# Altium schematic sheet S7CAS-PLEIADES-CARTE-MERE_P06_USB_PROGRAMER.SCHDOC
size Tabloid; SheetNumber: 18; SheetTotal: 18; Sheet_Name: USB_PROGRAMMER; Size: 11x17
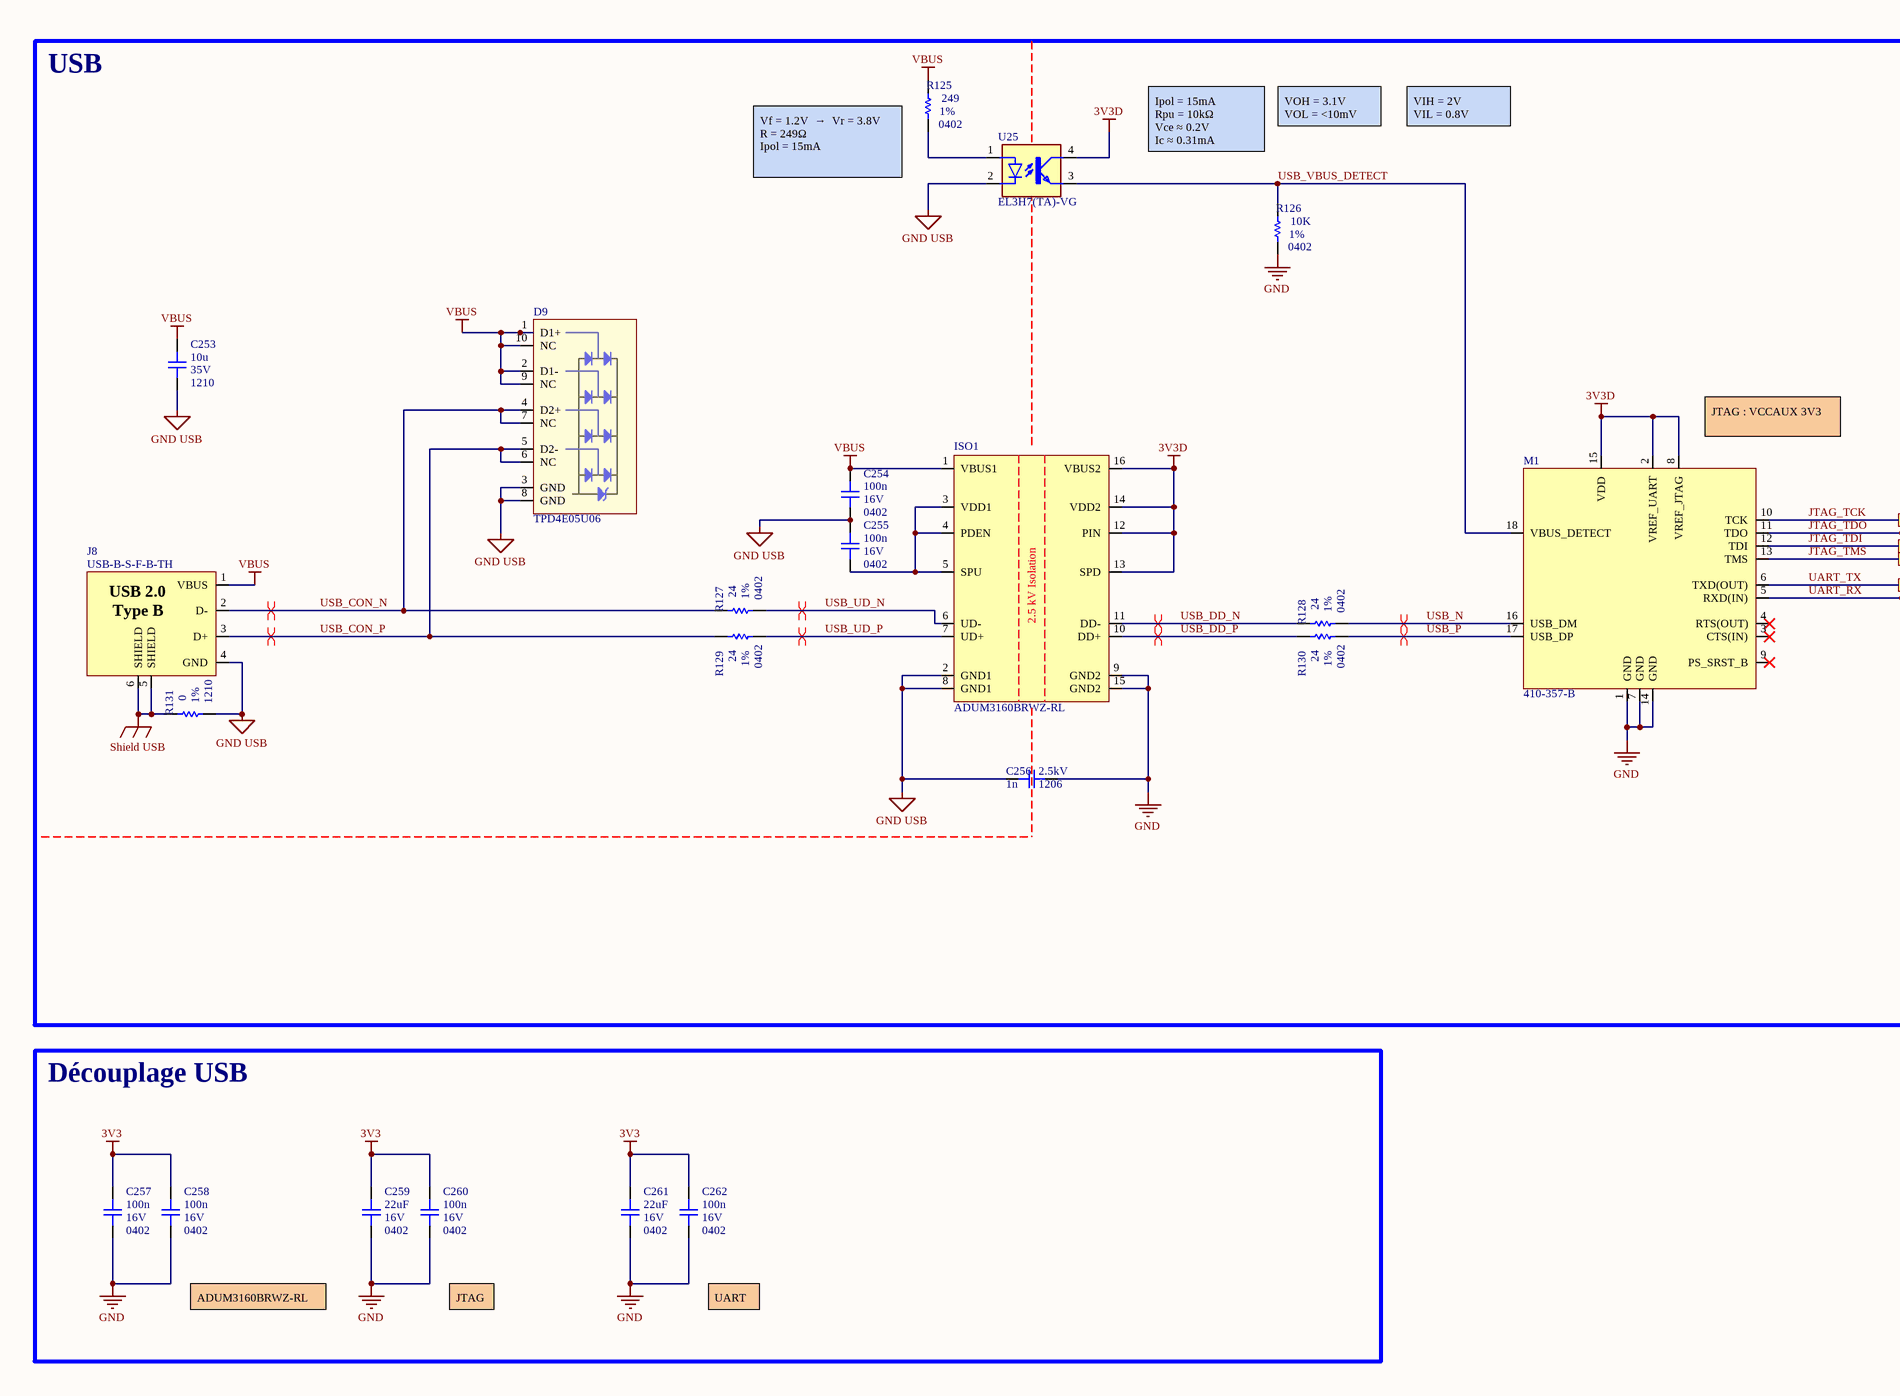
[diagram p0: S7CAS-PLEIADES-CARTE-MERE_P06_USB_PROGRAMER.SCHDOC, left]
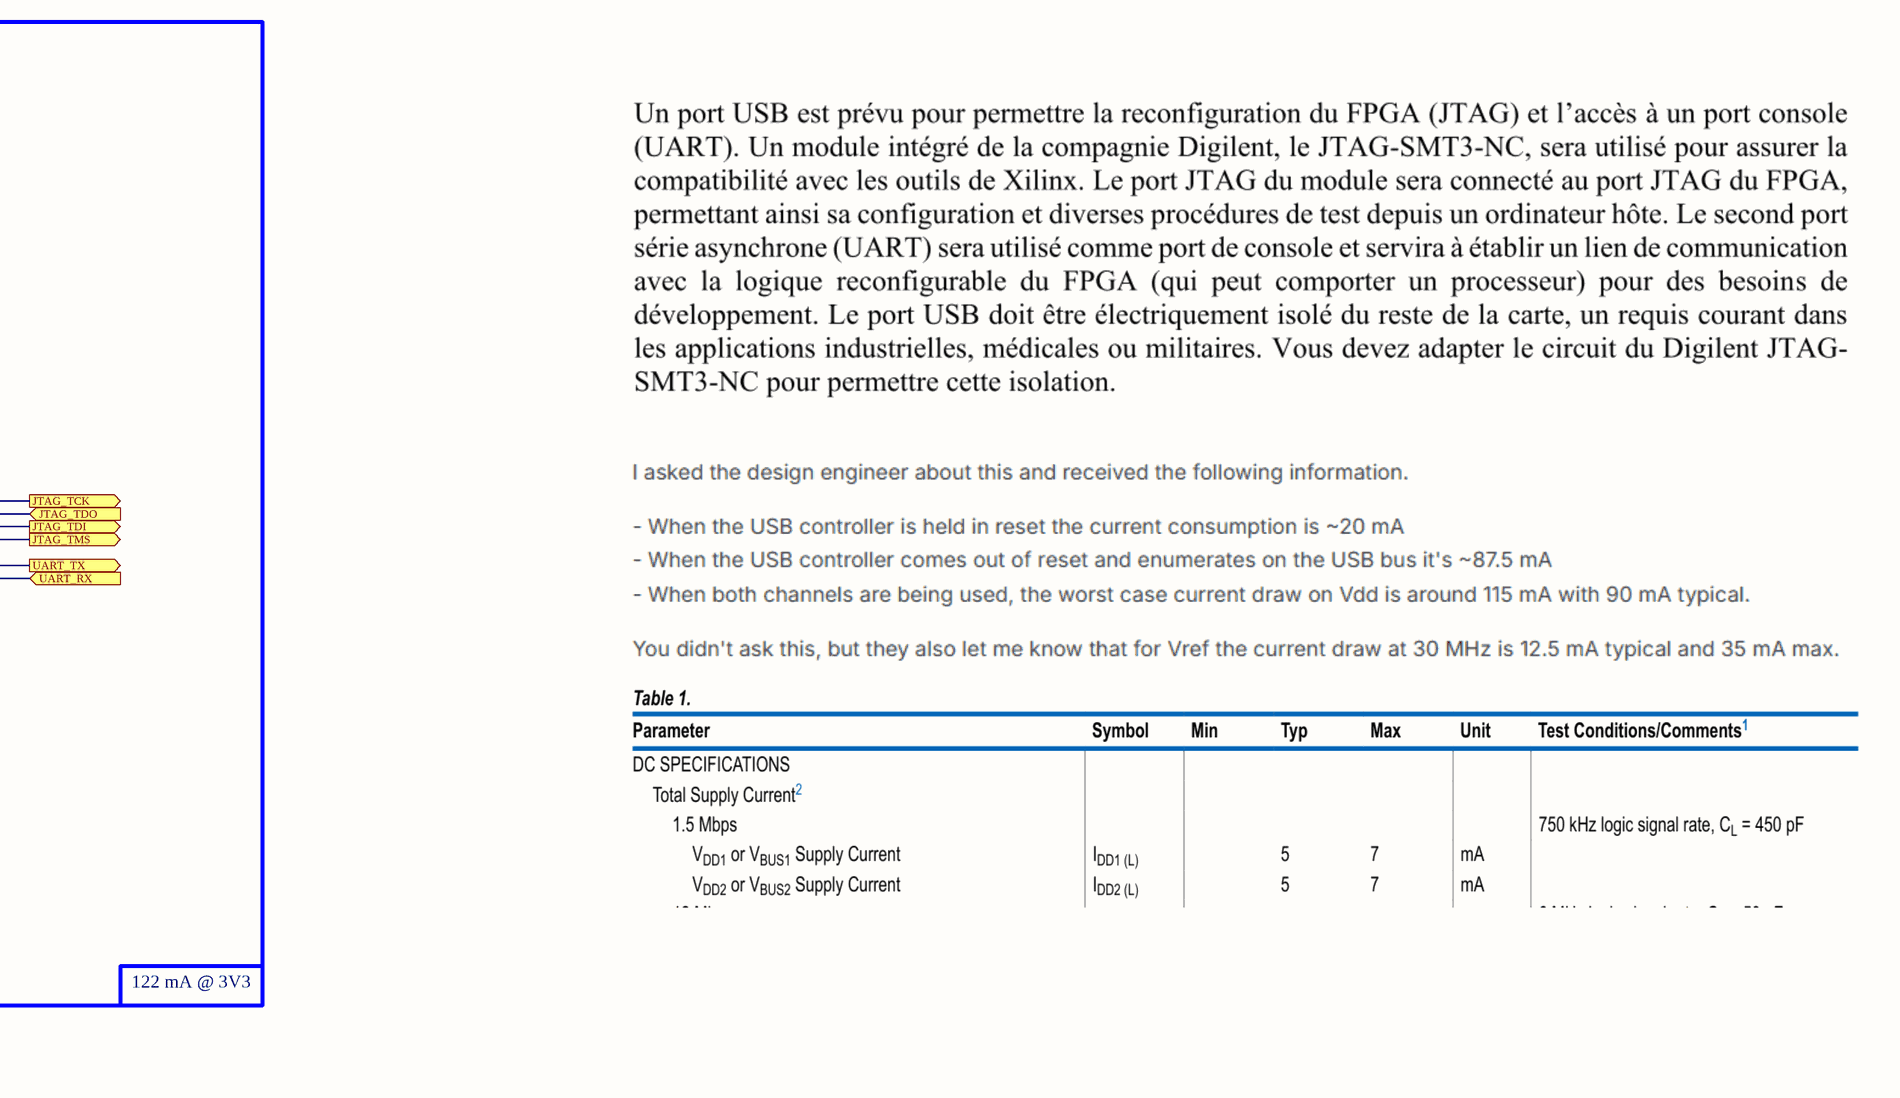
[diagram p1: S7CAS-PLEIADES-CARTE-MERE_P06_USB_PROGRAMER.SCHDOC, right]

## Parts
C253  value 10u  Voltage: 35V  Package: 1210  [CAP_1210]  (hidden comment: CAP - 1210)
C254  value 100n  Voltage: 16V  Package: 0402  [CAP_0402]  (hidden comment: CAP - 0402)
C255  value 100n  Voltage: 16V  Package: 0402  [CAP_0402]  (hidden comment: CAP - 0402)
C256  value 1n  Voltage: 2.5kV  Package: 1206  [CAP_0402]  (hidden comment: CAP - 0402)
C257  value 100n  Voltage: 16V  Package: 0402  [CAP_0402]  (hidden comment: CAP - 0402)
C258  value 100n  Voltage: 16V  Package: 0402  [CAP_0402]  (hidden comment: CAP - 0402)
C259  value 22uF  Voltage: 16V  Package: 0402  [CAP_0402]  (hidden comment: CAP - 0402)
C260  value 100n  Voltage: 16V  Package: 0402  [CAP_0402]  (hidden comment: CAP - 0402)
C261  value 22uF  Voltage: 16V  Package: 0402  [CAP_0402]  (hidden comment: CAP - 0402)
C262  value 100n  Voltage: 16V  Package: 0402  [CAP_0402]  (hidden comment: CAP - 0402)
D9  TPD4E05U06  [TVS_DATA_TPD4E05U06]
ISO1  ADUM3160BRWZ-RL  [ISO_ADUM3160BRWZ-RL]
J8  USB-B-S-F-B-TH  [CON_USB_USB-B-S-F-B-TH]
M1  410-357-B  [MOD_JTAG_410-357-B]
R125  value 249  Package: 0402  Precision: 1%  [RES_0402]  (hidden comment: RES - 0402)
R126  value 10K  Package: 0402  Precision: 1%  [RES_0402]  (hidden comment: RES - 0402)
R127  value 24  Package: 0402  Precision: 1%  [RES_0402]  (hidden comment: RES - 0402)
R128  value 24  Package: 0402  Precision: 1%  [RES_0402]  (hidden comment: RES - 0402)
R129  value 24  Package: 0402  Precision: 1%  [RES_0402]  (hidden comment: RES - 0402)
R130  value 24  Package: 0402  Precision: 1%  [RES_0402]  (hidden comment: RES - 0402)
R131  value 0  Package: 1210  Precision: 1%  [RES_1210]  (hidden comment: RES - 1210)
U25  EL3H7(TA)-VG  [SOIC127P700X200-4N]

## Blocks framed on the sheet
USB: C253-C256 D9 ISO1 J8 M1 R125-R131 U25
Découplage USB: C257-C262

## Ports
JTAG_TCK (out, see S7CAS-PLEIADES-CARTE-MERE_P06_FPGA4[5A]), JTAG_TDI (out, see S7CAS-PLEIADES-CARTE-MERE_P06_FPGA4[5A]), JTAG_TDO (in, see S7CAS-PLEIADES-CARTE-MERE_P06_FPGA4[5A]), JTAG_TMS (out, see S7CAS-PLEIADES-CARTE-MERE_P06_FPGA4[5A]), UART_RX (in, see S7CAS-PLEIADES-CARTE-MERE_P06_FPGA1[3A]), UART_TX (out, see S7CAS-PLEIADES-CARTE-MERE_P06_FPGA1[3A])

## Nets
3V3: C257.2 C258.2 C259.2 C260.2 C261.2 C262.2
3V3D: ISO1.12(PIN) ISO1.13(SPD) ISO1.14(VDD2) ISO1.16(VBUS2) M1.2(VREF_UART) M1.8(VREF_JTAG) M1.15(VDD) U25.4(COL)
GND: C256.1 C257.1 C258.1 C259.1 C260.1 C261.1 C262.1 ISO1.9(GND2) ISO1.15(GND2) M1.1(GND) M1.7(GND) M1.14(GND) R126.1
GND USB: C253.1 C254.1 C255.2 C256.2 D9.3(GND) D9.8(GND) ISO1.2(GND1) ISO1.8(GND1) J8.4(GND) R131.1 U25.2(C)
Shield USB: J8.5(SHIELD) J8.6(SHIELD) R131.2
VBUS: C253.2 C254.2 D9.1(D1+) D9.2(D1-) D9.9(NC) D9.10(NC) ISO1.1(VBUS1) J8.1(VBUS) R125.2
JTAG_TCK: M1.10(TCK) ; port JTAG_TCK
JTAG_TDI: M1.12(TDI) ; port JTAG_TDI
JTAG_TDO: M1.11(TDO) ; port JTAG_TDO
JTAG_TMS: M1.13(TMS) ; port JTAG_TMS
UART_RX: M1.5(RXD(IN)) ; port UART_RX
UART_TX: M1.6(TXD(OUT)) ; port UART_TX
USB_CON_N: D9.4(D2+) D9.7(NC) J8.2(D-) R127.2
USB_CON_P: D9.5(D2-) D9.6(NC) J8.3(D+) R129.2
USB_DD_N: ISO1.11(DD-) R128.2
USB_DD_P: ISO1.10(DD+) R130.2
USB_N: M1.16(USB_DM) R128.1
USB_P: M1.17(USB_DP) R130.1
USB_UD_N: ISO1.6(UD-) R127.1
USB_UD_P: ISO1.7(UD+) R129.1
USB_VBUS_DETECT: M1.18(VBUS_DETECT) R126.2 U25.3(EMIT)
NetC255_1: C255.1 ISO1.3(VDD1) ISO1.4(PDEN) ISO1.5(SPU)
NetR125_1: R125.1 U25.1(A)

Not connected (* = marked no-connect by the designer): M1 3(CTS(IN))* 4(RTS(OUT))* 9(PS_SRST_B)*

## Layout directives
differential pair: USB_CON_N, USB_CON_P
differential pair; differential pair class DIFF_USB: USB_DD_N, USB_DD_P, USB_N, USB_P, USB_UD_N, USB_UD_P

## Notes on the sheet
- Ipol = 15mA
  Rpu = 10kΩ
  Vce ≈ 0.2V
  Ic ≈ 0.31mA
- VOH = 3.1V
  VOL = <10mV
- VIH = 2V
  VIL = 0.8V
- (near R125) Vf = 1.2V  →  Vr = 3.8V
  R = 249Ω
  Ipol = 15mA
- (near M1) JTAG : VCCAUX 3V3
- 122 mA @ 3V3
- ADUM3160BRWZ-RL
- JTAG
- UART
- Sheet Name
- Project Title
- Global Project
- Size
- Group
- Revision
- Date
- Sheet
- of
- Filename
- Designers
- (in symbol CON_USB_USB-B-S-F-B-TH) USB 2.0; Type B
- (in symbol ISO_ADUM3160BRWZ-RL) 2.5 kV Isolation

## Library data of the parts
C253 = CAP - 1210: Precision: 10%; Current: *; CreatedBy: Jonathan Bouchard; Power: *
C254-C262 = CAP - 0402: Precision: 10%; Current: *; CreatedBy: Jonathan Bouchard; Power: *
D9 = TVS_DATA_TPD4E05U06: TVS - TVS DIODE 5.5VWM 14VC - 10SON; Manufacturer #1: Texas Instruments; Part Number #1: TPD4E05U06DQAR; Current Rating: 2.5A (8/20µs); Power Max: 40 W (peak); Value: 4 unidirectionnal channels; Voltage rating: 6V (Breakdown); Polarized: YES; Magnetic Material: UNKNOWN; GRAMS Lib Spec: 2.8; Manufacturer #2: *; Part Number #2: *; HelpURL: http://www.ti.com/lit/ds/symlink/tpd4e05u06.pdf; Supplier 1: Digi-Key; Supplier Part Number 1: 296-35765-1-ND; Note: *; Assembly Type: SMD; Temperature: -40°C ~ 125°C; Package: 10-USON; CreatedBy/Date: Olivier Bernard / 12/3/2018; Tolerance: *; VerifiedBy: Caroline Paulin / 4 juillet 2018; Cryo: UNKNOWN
ISO1 = ISO_ADUM3160BRWZ-RL: ISO - DGTL ISO 2.5KV 2CH USB - 16SOIC; Manufacturer #1: Analog Devices; Value: 2500Vrms voltage isolation; Voltage Rating: 3~5.5V; GRAMS Lib Spec: 2.8; Magnetic Material: UNKNOWN; Polarized: Yes; Tolerance: *; Current Rating: *; Power Max: *; HelpURL: https://www.analog.com/media/en/technical-documentation/data-sheets/ADuM3160.pdf; CreatedBy/Date: Tommy Rossignol 2018-11-16; VerifiedBy: Caroline Paulin - 13 février 2019; Temperature: -40°C ~ 105°C; Package: 16-SOIC; Manufacturer #2: *; Assembly Type: SMD; Part Number #2: *; Part Number #1: ADUM3160BRWZ-RL; Supplier 1: Digi-Key; Supplier Part Number 1: ADUM3160BRWZ-RLCT-ND; Cryo: UNKNOWN
J8 = CON_USB_USB-B-S-F-B-TH: CON - USB B RECPT TH R/A - 4-TH; Manufacturer #1: Samtec Inc.; Value: USB B; Voltage Rating: 30VAC; GRAMS Lib Spec: 2.8c; Magnetic Material: UNKNOWN; Polarized: YES; Tolerance: *; Current Rating: *; Power Max: *; HelpURL: http://suddendocs.samtec.com/catalog_english/usb_b.pdf; CreatedBy/Date: Jonathan Bouchard 2020-03-24; VerifiedBy: C.Paulin - 22/04/2020; Temperature: -50°C ~ 85°C; Package: 4-TH; Manufacturer #2: *; Note: *; Assembly Type: TH; Part Number #2: *; Part Number #1: USB-B-S-F-B-TH; Supplier 1: Digi-Key; Supplier Part Number 1: SAM10867-ND; Cryo: UNKNOWN
M1 = MOD_JTAG_410-357-B: MOD - JTAG-SMT3-NC Programming Module For Xilinx FPGA - 18-SMT; Manufacturer #1: Digilent; Voltage Rating: VDD: 2.97V~3.63V, VJTAG/VUART: 1.65V~5.5V; GRAMS Lib Spec: 2.8; Note: Prior to reflow, the JTAG-SMT3-NC module must be dried at 125°C for 17 hours; Magnetic Material: Unknown; Polarized: Yes; Value: *; Tolerance: *; Current Rating: *; Power Max: *; HelpURL: https://reference.digilentinc.com/_media/reference/programmers/jtag-smt3/jtag-smt3-nc_rm.pdf; CreatedBy/Date: Tommy Rossignol 2018-11-23; VerifiedBy: Nicolas V. (2019-01-28); Temperature: -40°C ~ 85°C; Package: 18-pad SMT; Manufacturer #2: *; Assembly Type: SMD; Part Number #2: *; Part Number #1: 410-357-B; Supplier 1: Digi-Key; Supplier Part Number 1: 1286-1196-ND; Cryo: UNKNOWN
R125-R130 = RES - 0402: Voltage: 50V; Power: 1/16W; Current: *; CreatedBy: Jonathan Bouchard
R131 = RES - 1210: Power: 1/16W; Current: *; CreatedBy: Jonathan Bouchard
U25 = EL3H7(TA)-VG: Optoisolator Transistor Output 3750Vrms 1 Channel 4-SSOP; MF: Everlight Electronics; SnapEDA_Link: https://www.snapeda.com/parts/EL3H7(TA)-VG/Everlight/view-part/?ref=snap; Package: SSOP-4 Everlight; Value: *; MP: EL3H7(TA)-VG; Check_prices: https://www.snapeda.com/parts/EL3H7(TA)-VG/Everlight/view-part/?ref=eda